# EAGLE design TopPCB-011113 (EAGLE 6.3)
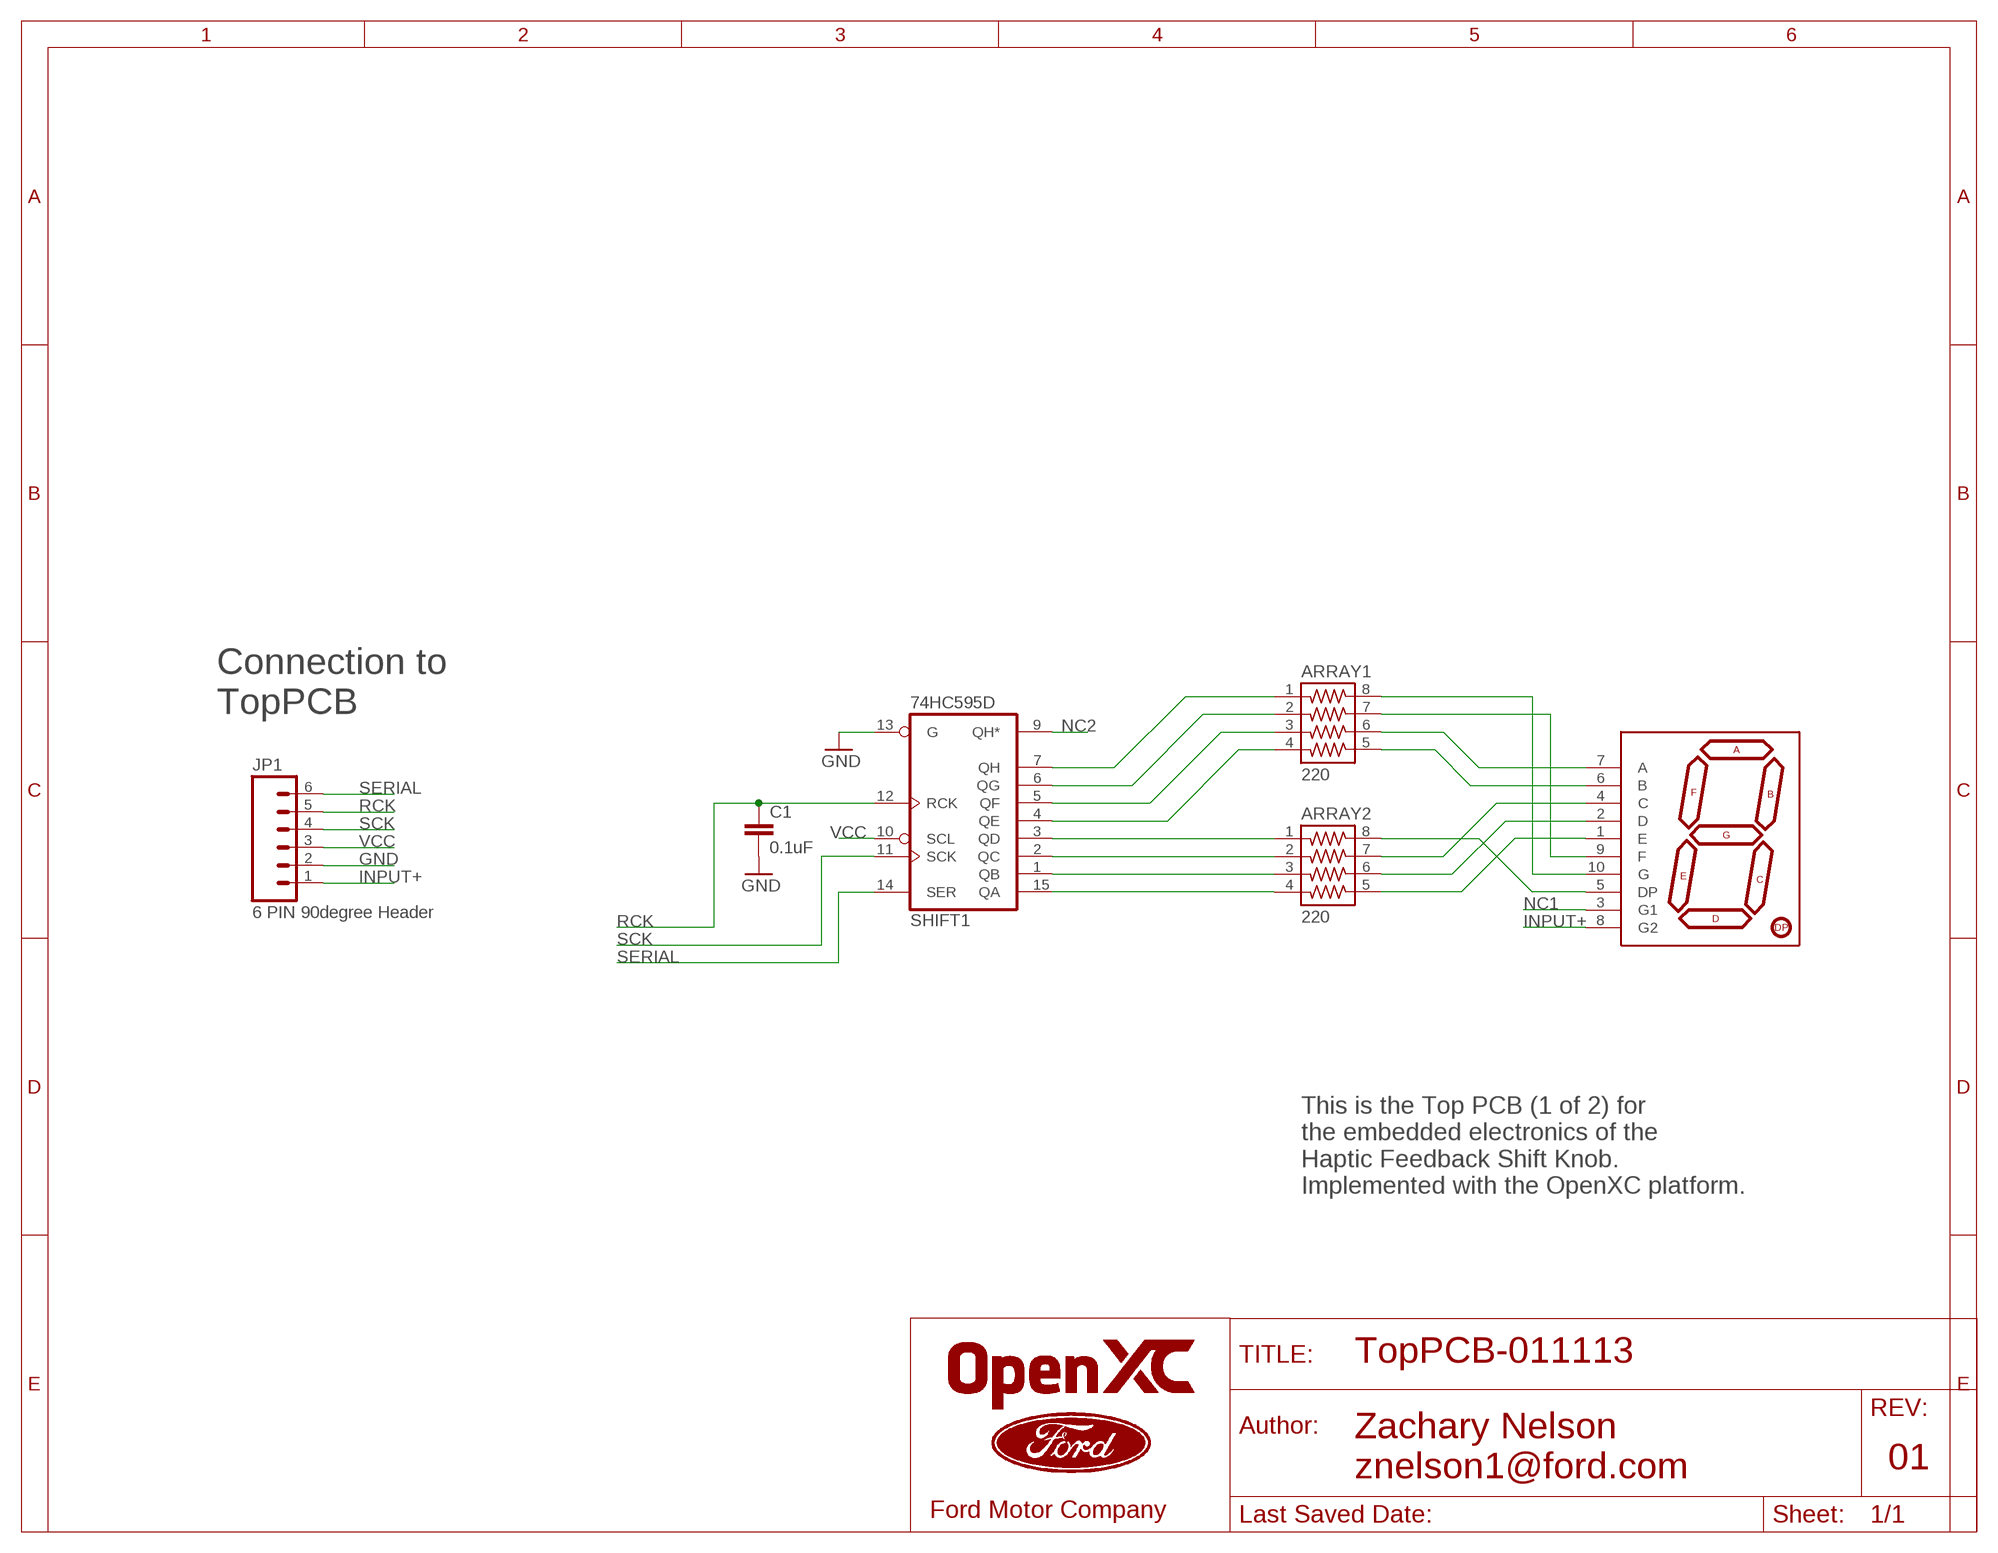
[diagram p0: schematic, sheet 1]

## Parts
7SEGMENT  7-SEGMENT-DISPLAY-1"-RED  [7-SEGMENT-1"PTH]
ARRAY1  220  744-8  [744-8]
ARRAY2  220  744-8  [744-8]
C1  0.1uF  CAP0402-CAP  [0402-CAP]
JP1  6 PIN 90degree Header  M06SIP  [1X06]
SHIFT1  74HC595D  [SO16]

## Nets
GND: C1.2 JP1.2 SHIFT1.13(G)
INPUT+: 7SEGMENT.8(G2) JP1.1
N$1: 7SEGMENT.5(DP) ARRAY2.8
N$2: ARRAY2.3 SHIFT1.1(QB)
N$3: 7SEGMENT.1(E) ARRAY2.5
N$4: ARRAY2.2 SHIFT1.2(QC)
N$5: ARRAY2.1 SHIFT1.3(QD)
N$7: 7SEGMENT.4(C) ARRAY2.7
N$8: 7SEGMENT.6(B) ARRAY1.5
N$9: ARRAY2.4 SHIFT1.15(QA)
N$10: ARRAY1.4 SHIFT1.4(QE)
N$11: ARRAY1.3 SHIFT1.5(QF)
N$12: ARRAY1.2 SHIFT1.6(QG)
N$13: ARRAY1.1 SHIFT1.7(QH)
N$14: 7SEGMENT.7(A) ARRAY1.6
N$15: 7SEGMENT.9(F) ARRAY1.7
N$16: 7SEGMENT.10(G) ARRAY1.8
N$19: 7SEGMENT.2(D) ARRAY2.6
NC1: 7SEGMENT.3(G1)
NC2: SHIFT1.9(QH*)
RCK: C1.1 JP1.5 SHIFT1.12(RCK)
SCK: JP1.4 SHIFT1.11(SCK)
SERIAL: JP1.6 SHIFT1.14(SER)
VCC: JP1.3 SHIFT1.10(SCL)

## Notes on the sheet
- Connection to 
  TopPCB
- This is the Top PCB (1 of 2) for 
  the embedded electronics of the 
  Haptic Feedback Shift Knob. 
  Implemented with the OpenXC platform.
- 01
- Zachary Nelson
  znelson1@ford.com

## Power pins joined to a net without a drawn wire
GND: SHIFT1.8(GND)
VCC: SHIFT1.16(VCC)

## Library data of the parts
7SEGMENT = SparkFun-Displays:7-SEGMENT-DISPLAY-1"-RED: 7-Segment Display 1" Red (COM-08546)
ARRAY1 ARRAY2 = resistor-array:744-8: CTS 744 Series 4 Resistors, 8 Terminations
C1 = SparkFun-Capacitors:CAP: Capacitor Standard 0603 ceramic capacitor, and 0.1" leaded capacitor.
JP1 = SparkFun-Connectors:M06: Header 6 Standard 6-pin 0.1" header. Use with straight break away headers (SKU : PRT-00116), right angle break away headers (PRT-00553), swiss pins (PRT-00743), machine pins (PRT-00117), and female headers (PRT-00115). Molex polarized connector foot print use with SKU : PRT-08094 with associated crimp pins and housings. NOTES ON THE VARIANTS LOCK and LOCK_LONGPADS... This footprint was designed to help hold the alignment of a through-hole component (i.e. 6-pin header) while soldering it into place. You may notice that each hole has been shifted either up or down by 0.005 of an inch from it's more standard position (which is a perfectly straight line). This slight alteration caused the pins (the squares in the middle) to touch the edges of the holes. Because they are alternating, it causes a "brace" to hold the component in place. 0.005 has proven to be the perfect amount of "off-center" position when using our standard breakaway headers. Although looks a little odd when you look at the bare footprint, once you have a header in there, the alteration is very hard to notice. Also, if you push a header all the way into place, it is covered up entirely on the bottom side. This idea of altering the position of holes to aid alignment will be further integrated into the Sparkfun Library for other footprints. It can help hold any component with 3 or more connection pins.
SHIFT1 = 74xx-eu:74*595: 8-bit SHIFT REGISTER, output latch

## Board
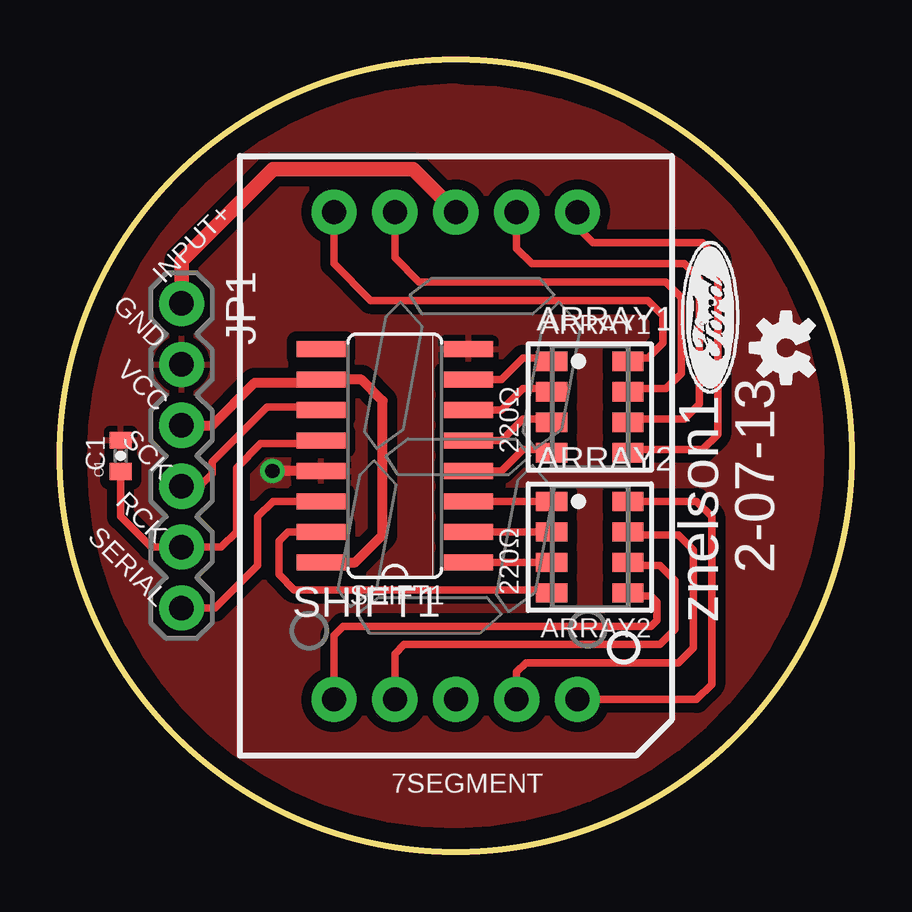
[diagram p1: board, top side]
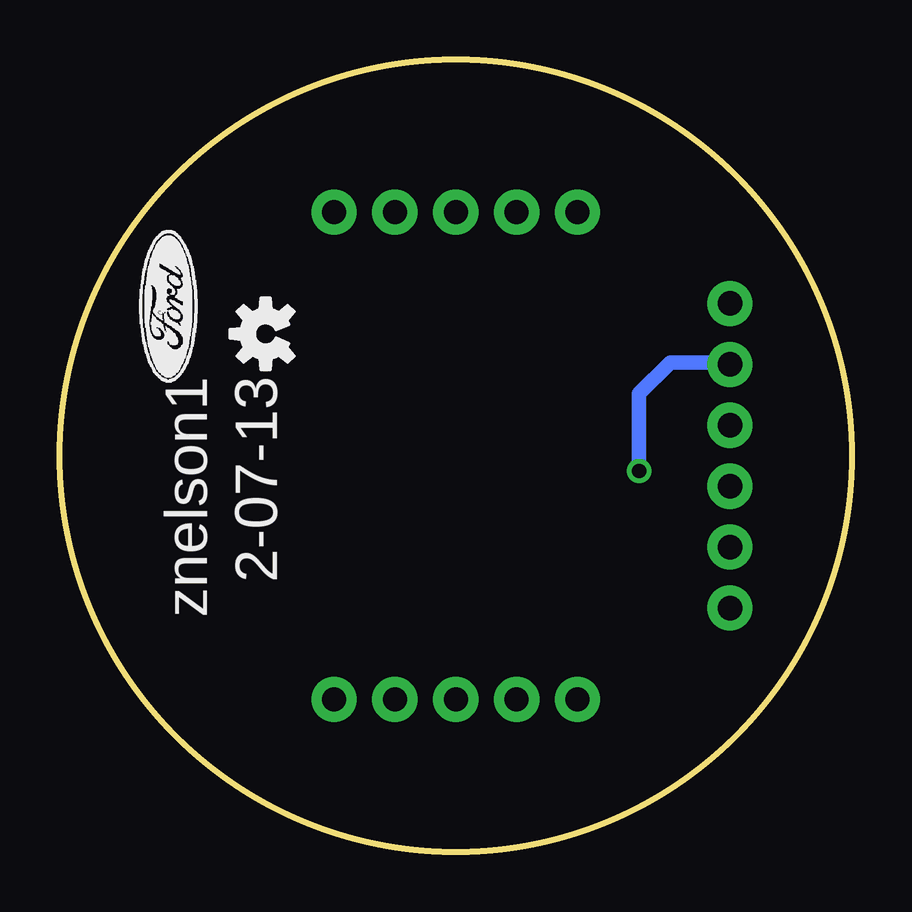
[diagram p2: board, bottom side, seen from below]

Size 33 x 33 mm. Coordinates in mm from the lower left corner, seen from the top.
Outline: circle at 16.5,16.5 radius 16.5
Copper layers (1*16): Top 0.0178mm / dielectric 59mil / Bottom 0.0178mm
Design rules "SSC-EAGLE-2Lyr_v1.0.0.3": minimum track width 6mil, minimum drill 14mil, track to track 6mil, track to pad 6mil, pad to pad 6mil, via to via 6mil, smd to smd 6mil, copper to edge 20mil, drill to drill 16mil, minimum pad ring 8mil, minimum via ring 8mil, stop-mask expansion 3mil, vias tented up to drill 0mil, thermal gap 10mil

### Footprints (pad centres in the part's own frame; a part is rotated, then mirrored left to right if it is on the bottom)
7-SEGMENT-1"PTH = drill 1 pad 1.88: 1 -5.08,-10.16; 2 -2.54,-10.16; 3 0,-10.16; 4 2.54,-10.16; 5 5.08,-10.16; 6 5.08,10.16; 7 2.54,10.16; 8 0,10.16; 9 -2.54,10.16; 10 -5.08,10.16
744-8 = smd 0.8 x 1.3: 1 -1.905,-1.587; 2 -0.635,-1.587; 3 0.635,-1.587; 4 1.905,-1.587; 5 1.905,1.587; 6 0.635,1.587; 7 -0.635,1.587; 8 -1.905,1.587
0402-CAP = smd 0.7 x 0.9: 1 -0.65,0; 2 0.65,0
1X06 = drill 1.016 pad 1.88: 1 0,0; 2 2.54,0; 3 5.08,0; 4 7.62,0; 5 10.16,0; 6 12.7,0
SO16 = smd 0.66 x 2.032: 1 -4.445,-3.073; 2 -3.175,-3.073; 3 -1.905,-3.073; 4 -0.635,-3.073; 5 0.635,-3.073; 6 1.905,-3.073; 7 3.175,-3.073; 8 4.445,-3.073; 9 4.445,3.073; 10 3.175,3.073; 11 1.905,3.073; 12 0.635,3.073; 13 -0.635,3.073; 14 -1.905,3.073; 15 -3.175,3.073; 16 -4.445,3.073

### Placement (x,y rotation side)
7SEGMENT  16.5,16.5 0 top
ARRAY1  22.09,18.53 270 top
ARRAY2  22.09,12.69 270 top
C1  2.53,16.5 90 top
JP1  5.07,22.85 270 top
SHIFT1  13.96,16.5 90 top
U$1  OSHW-LOGOS  [OSHW-LOGO-S]  30.27,21 90 top
U$2  OSHW-LOGOS  [OSHW-LOGO-S]  24.42,21.58 90 bottom
U$3  [DOCFIELD]  -50.81,-49.54 0 top  (outside the outline)

### Tracks (layer width: path | path; a pad name or v marks a point on that pad's centre or on a via)
GND  (via drill 0.6)
  Top 0.406: SHIFT1.13 v8.85,15.86
  Bottom 0.406: 5.15,20.39 JP1.2
  Bottom 0.61: v8.85,15.86 8.85,19.09 7.56,20.39 5.15,20.39
  pour Top (isolate 0.406): 1.26,16.32 arc-90 16.42,31.92 16.78,31.87 arc-90 31.74,16.7 arc-90 16.5,1.08 arc-91
INPUT+
  Top 0.61: 7SEGMENT.8 14.72,28.44 8.88,28.44 5.07,24.63 JP1.1
N$1
  Top 0.305: ARRAY2.8 26.53,14.59 27.17,13.96 27.17,6.97 26.53,6.34 7SEGMENT.5
N$2
  Top 0.305: SHIFT1.1 ARRAY2.3
N$3
  Top 0.305: 7SEGMENT.1 11.42,9.01 11.8,9.39 24.63,9.39 24.88,9.64 24.88,10.4 24.63,10.66 23.93,10.66 ARRAY2.5
N$4
  Top 0.305: ARRAY2.2 SHIFT1.2
N$5
  Top 0.305: SHIFT1.3 ARRAY2.1 20.63,14.72
N$7
  Top 0.305: 7SEGMENT.4 19.04,7.48 19.42,7.86 25.77,7.86 26.41,8.5 26.41,12.56 25.77,13.2 23.68,13.2 ARRAY2.7
N$8
  Top 0.254: 23.93,16.75 ARRAY1.5
  Top 0.305: 7SEGMENT.6 21.58,26.02 22.21,25.39 26.79,25.39 27.42,24.75 27.42,17.39 26.79,16.75 23.93,16.75
N$9
  Top 0.305: SHIFT1.15 9.51,13.32 9.13,12.94 9.13,11.55 9.77,10.91 20.63,10.91 ARRAY2.4
N$10
  Top 0.305: SHIFT1.4 18.4,15.86 19.29,16.75 20.63,16.75
  Top 0.406: 20.63,16.75 ARRAY1.4
N$11
  Top 0.254: 20.63,18.02 ARRAY1.3
  Top 0.305: SHIFT1.5 18.4,17.13 19.29,18.02 20.63,18.02
N$12
  Top 0.254: 20.63,19.29 ARRAY1.2
  Top 0.305: SHIFT1.6 18.4,18.4 19.29,19.29 20.63,19.29
N$13
  Top 0.254: 20.63,20.56 ARRAY1.1
  Top 0.305: SHIFT1.7 18.4,19.67 19.29,20.56 20.63,20.56
N$14
  Top 0.254: 23.93,18.02 ARRAY1.6
  Top 0.305: 7SEGMENT.7 19.04,25.14 19.67,24.5 26.02,24.5 26.66,23.87 26.66,18.66 26.02,18.02 23.93,18.02
N$15
  Top 0.254: 23.93,19.29 ARRAY1.7
  Top 0.305: 7SEGMENT.9 13.96,24.75 14.98,23.74 25.26,23.74 25.9,23.1 25.9,19.93 25.26,19.29 23.93,19.29
N$16
  Top 0.254: 23.93,20.56 ARRAY1.8
  Top 0.305: 23.93,20.56 24.5,20.56 25.14,21.2 25.14,22.34 24.5,22.98 12.94,22.98 11.42,24.5 7SEGMENT.10
N$19
  Top 0.305: 7SEGMENT.2 13.96,8.24 14.34,8.63 25.01,8.63 25.64,9.26 25.64,11.29 25.01,11.93 23.93,11.93 ARRAY2.6
RCK
  Top 0.305: 10.76,17.01 8.37,17.01 7.36,15.99 7.36,13.32 6.72,12.69 JP1.5 3.8,12.69 2.53,13.96 C1.1
  Top 0.406: 10.76,17.01 SHIFT1.12
SCK
  Top 0.305: 5.83,15.23 6.34,15.74 6.34,16.25 8.63,18.53 10.76,18.53
  Top 0.406: JP1.4 5.83,15.23 | 10.76,18.53 SHIFT1.11
SERIAL
  Top 0.305: JP1.6 6.47,10.15 8.24,11.93 8.24,13.96 8.88,14.59 SHIFT1.14
VCC
  Top 0.406: SHIFT1.16 12.31,12.05 13.45,13.2 13.45,18.79 12.56,19.67 SHIFT1.10 10.76,19.55 8.12,19.55 6.34,17.77 JP1.3

### Text on the board
tPlace: INPUT+ | GND | ARRAY1 | 2-07-13 | VCC | znelson1 | 220Ω | C1 | SCK | RCK | SERIAL | SHIFT1 | 220Ω | ARRAY2 | 7SEGMENT
bPlace: 2-07-13 | znelson1
Document: 01 | Zachary Nelson / znelson1@ford.com